# Altium schematic sheet DB10011_Toplevel.SchDoc: Toplevel Schematic
size A3; Engineer: Danny Bokma; Revision: V0.3; SheetNumber: 1; SheetTotal: 7
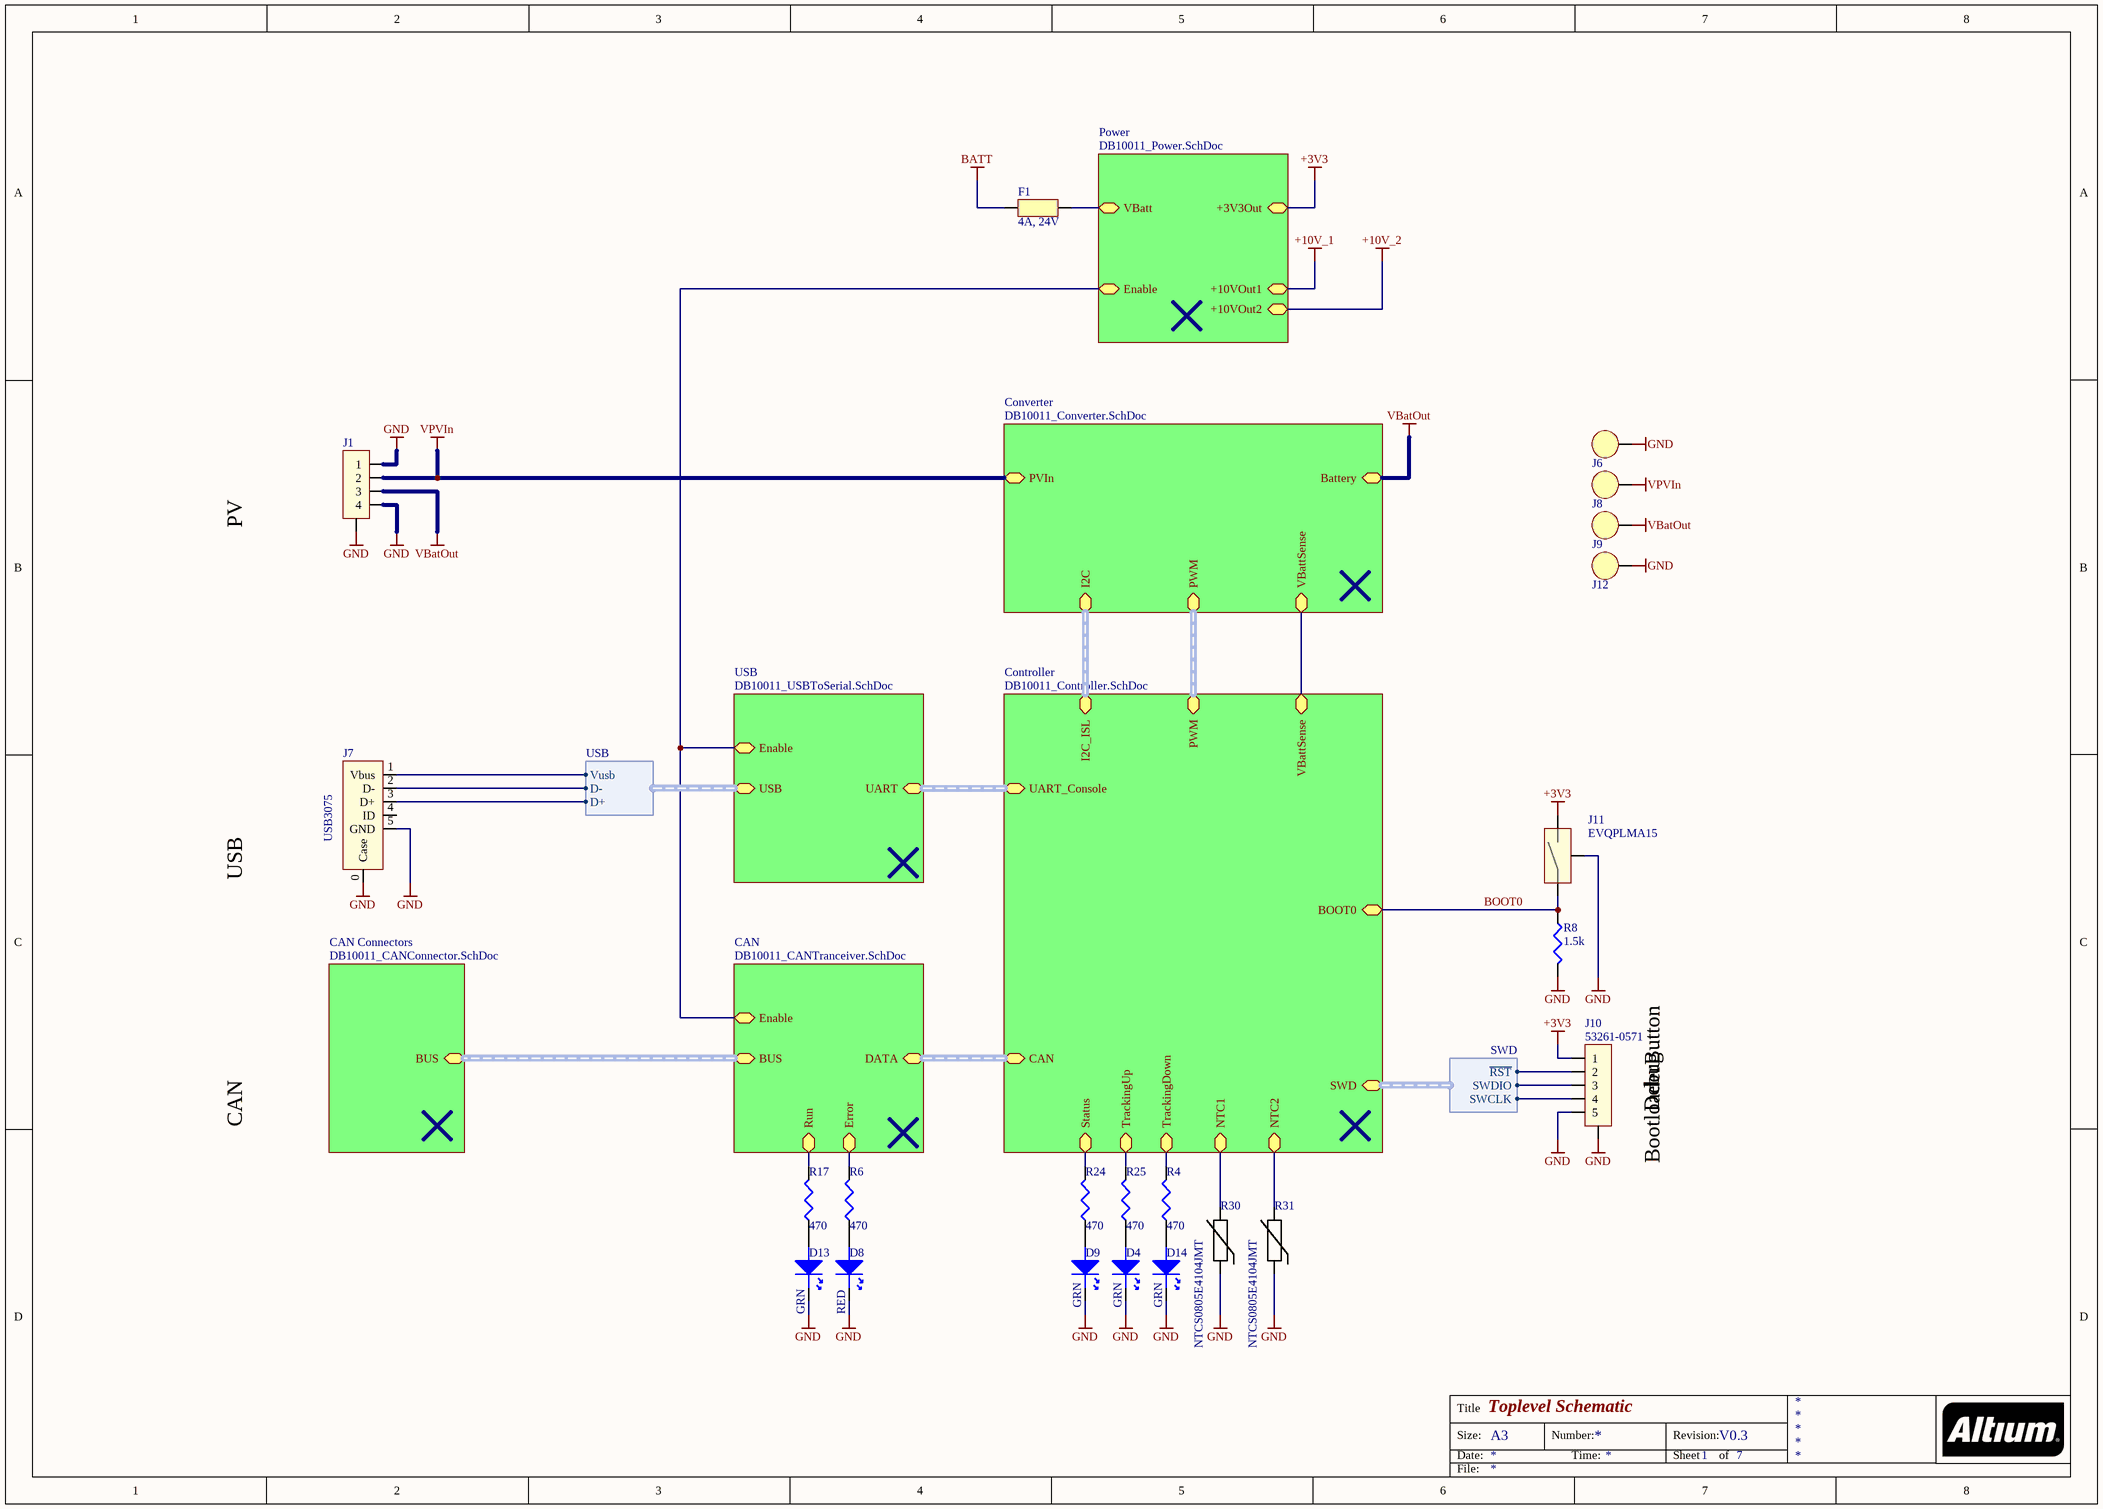
[diagram p0: DB10011_Toplevel.SchDoc]

## Parts
D4  GRN  [WL-SMRW_1206 cylindrical_Reverse use]
D8  RED  [WL-SMRW_1206 cylindrical_Reverse use]
D9  GRN  [WL-SMRW_1206 cylindrical_Reverse use]
D13  GRN  [WL-SMRW_1206 cylindrical_Reverse use]
D14  GRN  [WL-SMRW_1206 cylindrical_Reverse use]
F1  4A, 24V  [F1206]
J1  Header 1x4  [PC 4/ 4-G-7,62]  (value not drawn)
J6  M3 5mm SMD spacer  [M3_5MM_Spacer]  (value not drawn)
J7  USB3075  [USB3075 - NOSLOT]
J8  M3 5mm SMD spacer  [M3_5MM_Spacer]  (value not drawn)
J9  M3 5mm SMD spacer  [M3_5MM_Spacer]  (value not drawn)
J10  53261-0571  [53261-0571]
J11  EVQPLMA15  [EVQPLM]
J12  M3 5mm SMD spacer  [M3_5MM_Spacer]  (value not drawn)
R4  470  [0402]
R6  470  [0402]
R8  1.5k  [0402]
R17  470  [0402]
R24  470  [0402]
R25  470  [0402]
R30  NTCS0805E4104JMT  [0805]
R31  NTCS0805E4104JMT  [0805]

## Sub-sheets
CAN = DB10011_CANTranceiver.SchDoc: Enable, BUS (harness CAN), Error, Run, DATA (harness CAN_DATA)
CAN Connectors = DB10011_CANConnector.SchDoc: BUS (harness CAN)
Controller = DB10011_Controller.SchDoc: I2C_ISL (harness I2C), VBattSense, PWM (harness PWM), CAN (harness CAN_DATA), UART_Console (harness SERIAL), TrackingUp, TrackingDown, Status, BOOT0, SWD (harness SWD), NTC1, NTC2
Converter = DB10011_Converter.SchDoc: PVIn, Battery, VBattSense, I2C (harness I2C), PWM (harness PWM)
Power = DB10011_Power.SchDoc: VBatt, +3V3Out, Enable, +10VOut1, +10VOut2
USB = DB10011_USBToSerial.SchDoc: UART (harness SERIAL), Enable, USB (harness USB)

## Harnesses
SWD: SWCLK, SWDIO, ~{RST}
USB: Vusb, D+, D-

## Nets
+3V3: J10.1 J11.2 ; sheet Power/+3V3Out
+10V_1: sheet Power/+10VOut1
+10V_2: sheet Power/+10VOut2
BATT: F1.2
GND: D4.1(K) D8.1(K) D9.1(K) D13.1(K) D14.1(K) J1.0 J1.1 J1.4 J6.0 J7.0(Case) J7.5(GND) J10.0(SHLD) J10.5 J11.0(GND) J12.0 R8.1 R30.1 R31.1
VBatOut: J1.3 J9.0 ; sheet Converter/Battery
VPVIn: J1.2 J8.0 ; sheet Converter/PVIn
BOOT0: J11.1 R8.2 ; sheet Controller/BOOT0
NetD4_2: D4.2(A) R25.1
NetD8_2: D8.2(A) R6.1
NetD9_2: D9.2(A) R24.1
NetD13_2: D13.2(A) R17.1
NetD14_2: D14.2(A) R4.1
NetF1_1: F1.1 ; sheet Power/VBatt
NetJ7_1: J7.1(Vbus) ; sheet USB/USB.Vusb
NetJ7_2: J7.2(D-) ; sheet USB/USB.D-
NetJ7_3: J7.3(D+) ; sheet USB/USB.D+
NetJ10_2: J10.2 ; sheet Controller/SWD.~{RST}
NetJ10_3: J10.3 ; sheet Controller/SWD.SWDIO
NetJ10_4: J10.4 ; sheet Controller/SWD.SWCLK
NetR4_2: R4.2 ; sheet Controller/TrackingDown
NetR6_2: R6.2 ; sheet CAN/Error
NetR17_2: R17.2 ; sheet CAN/Run
NetR24_2: R24.2 ; sheet Controller/Status
NetR25_2: R25.2 ; sheet Controller/TrackingUp
NetR30_2: R30.2 ; sheet Controller/NTC1
NetR31_2: R31.2 ; sheet Controller/NTC2
(unnamed): sheet Power/Enable, sheet CAN/Enable, sheet USB/Enable
(unnamed): sheet Converter/VBattSense, sheet Controller/VBattSense

Not connected (* = marked no-connect by the designer): J7 4(ID)

## Buses and harness runs
harness sheet CAN Connectors/BUS = sheet CAN/BUS
harness sheet CAN/DATA = sheet Controller/CAN
harness sheet Controller/I2C_ISL = sheet Converter/I2C
harness sheet Controller/PWM = sheet Converter/PWM
harness sheet Controller/UART_Console = sheet USB/UART

## Notes on the sheet
- PV
- USB
- BootloaderButton
- CAN
- (near J10) Debug
- Title
- Size:
- Date:
- A3
- Number:
- Time:
- Revision:
- Sheet
- of
- File:

## Library data of the parts
D4 D9 D13 D14 = 156120GS75300: LED, Reverse Mount, Cylindrical, Green; Brand: Wurth; Brand Number: 156120GS75300; Order Code Supplier: 2322091; Price: 0,519; Supplier: Farnell
D8 = 156120RS75300: LED, Reverse Mount, Cylindrical, Red; Brand: Wurth; Brand Number: 156120RS75300; Order Code Supplier: 2322094; Price: 0,519; Supplier: Farnell
F1 = MC12CT 004: Fuse, Slow Blow, 4A, 24V, T:-55°C +125°C; Prijs: 0,161; Brand: MULTICOMP; Order Code Supplier: 1841066; Brand Number: MC12CT 004; Supplier: Farnell
J1 = PC 4/4-G-7,62_1: Header, Close Horizontal, 1x4, Male, 7.62mm, TH; Brand: PHOENIX CONTACT; Brand Number: PC 4/4-G-7,62; Case Style: *; Order Code Supplier: 1792930; Pitch: 7.62mm; Price: 2,92; Supplier: Farnell
J6 J8 J9 J12 = 9774050360RWPad: M3 5MM Spacer; Brand: WURTH ELEKTRONIK; Brand Number: 9774050360R; Price: 1.91; Order Code Supplier: 2438004; Supplier: WURTH ELEKTRONIK
J7 = USB3075: USB 2.0 MICRO B, RCPT, 5POS, SMT; Brand: Global Connector Technology; Brand Number: USB3075-30-A; Case Style: Micro B SMT; Pitch: 0.8mm; Order Code Supplier: 2443116; Price: 0,313; Supplier: Farnell
J10 = 53261-0571: PicoBlade 53261 Series, 5Pin, Right Angle; Brand: MOLEX; Pitch: 1.25mm; Brand Number: 53261-0571; Case Style: 53261-0571; Order Code Supplier: 1125360; Price: 1,20; Supplier: Farnell
J11 = EVQPLMA15: SWITCH, TACT, 4.9MM, SMD, 2.6N; Brand: PANASONIC ELECTRONIC COMPONENTS; Brand Number: EVQPLMA15; Price: 0,169; Order Code Supplier: 2079484; Supplier: Farnell
R4 R6 R17 R24 R25 = 470/0402/0063W/50V: Resistor, 470, 1%, 0.0625W, 50V, 100PPM, 0402; Brand: VISHAY DRALORIC; Brand Number: CRG0402F470R; Power Rating: 0.063W; Case Style: 0402; Order Code Supplier: 2331533; Price: 0,0099; Resistance: 470; Supplier: Farnell; Temperature Coefficient: ± 100PPM; Temperature Range: -55°C to +125°C; Voltage Rating: 50V
R8 = 1.5k/0402/0063W/50V: Resistor, 1.5k, 0.1%, 0.0625W, 50V, 100PPM, 0402; Brand: VISHAY DRALORIC; Brand Number: CRCW04021K50FKED; Power Rating: 0.063W; Case Style: 0402; Order Code Supplier: 2121624; Price: 0,0054; Resistance: 1.5k; Supplier: Farnell; Temperature Coefficient: ± 100PPM; Temperature Range: -55°C to +125°C; Voltage Rating: 50V
R30 R31 = NTCS0805E4104JMT: THERMISTOR, NTC, 100K, 5%; Brand: VISHAY; Supplier: Farnell; Case Style: 0805; Price: 0,65; Order Code Supplier: 1187095; Brand Number: NTCS0805E4104JMT